# EAGLE schematic powerboard (EAGLE 9.6.2)
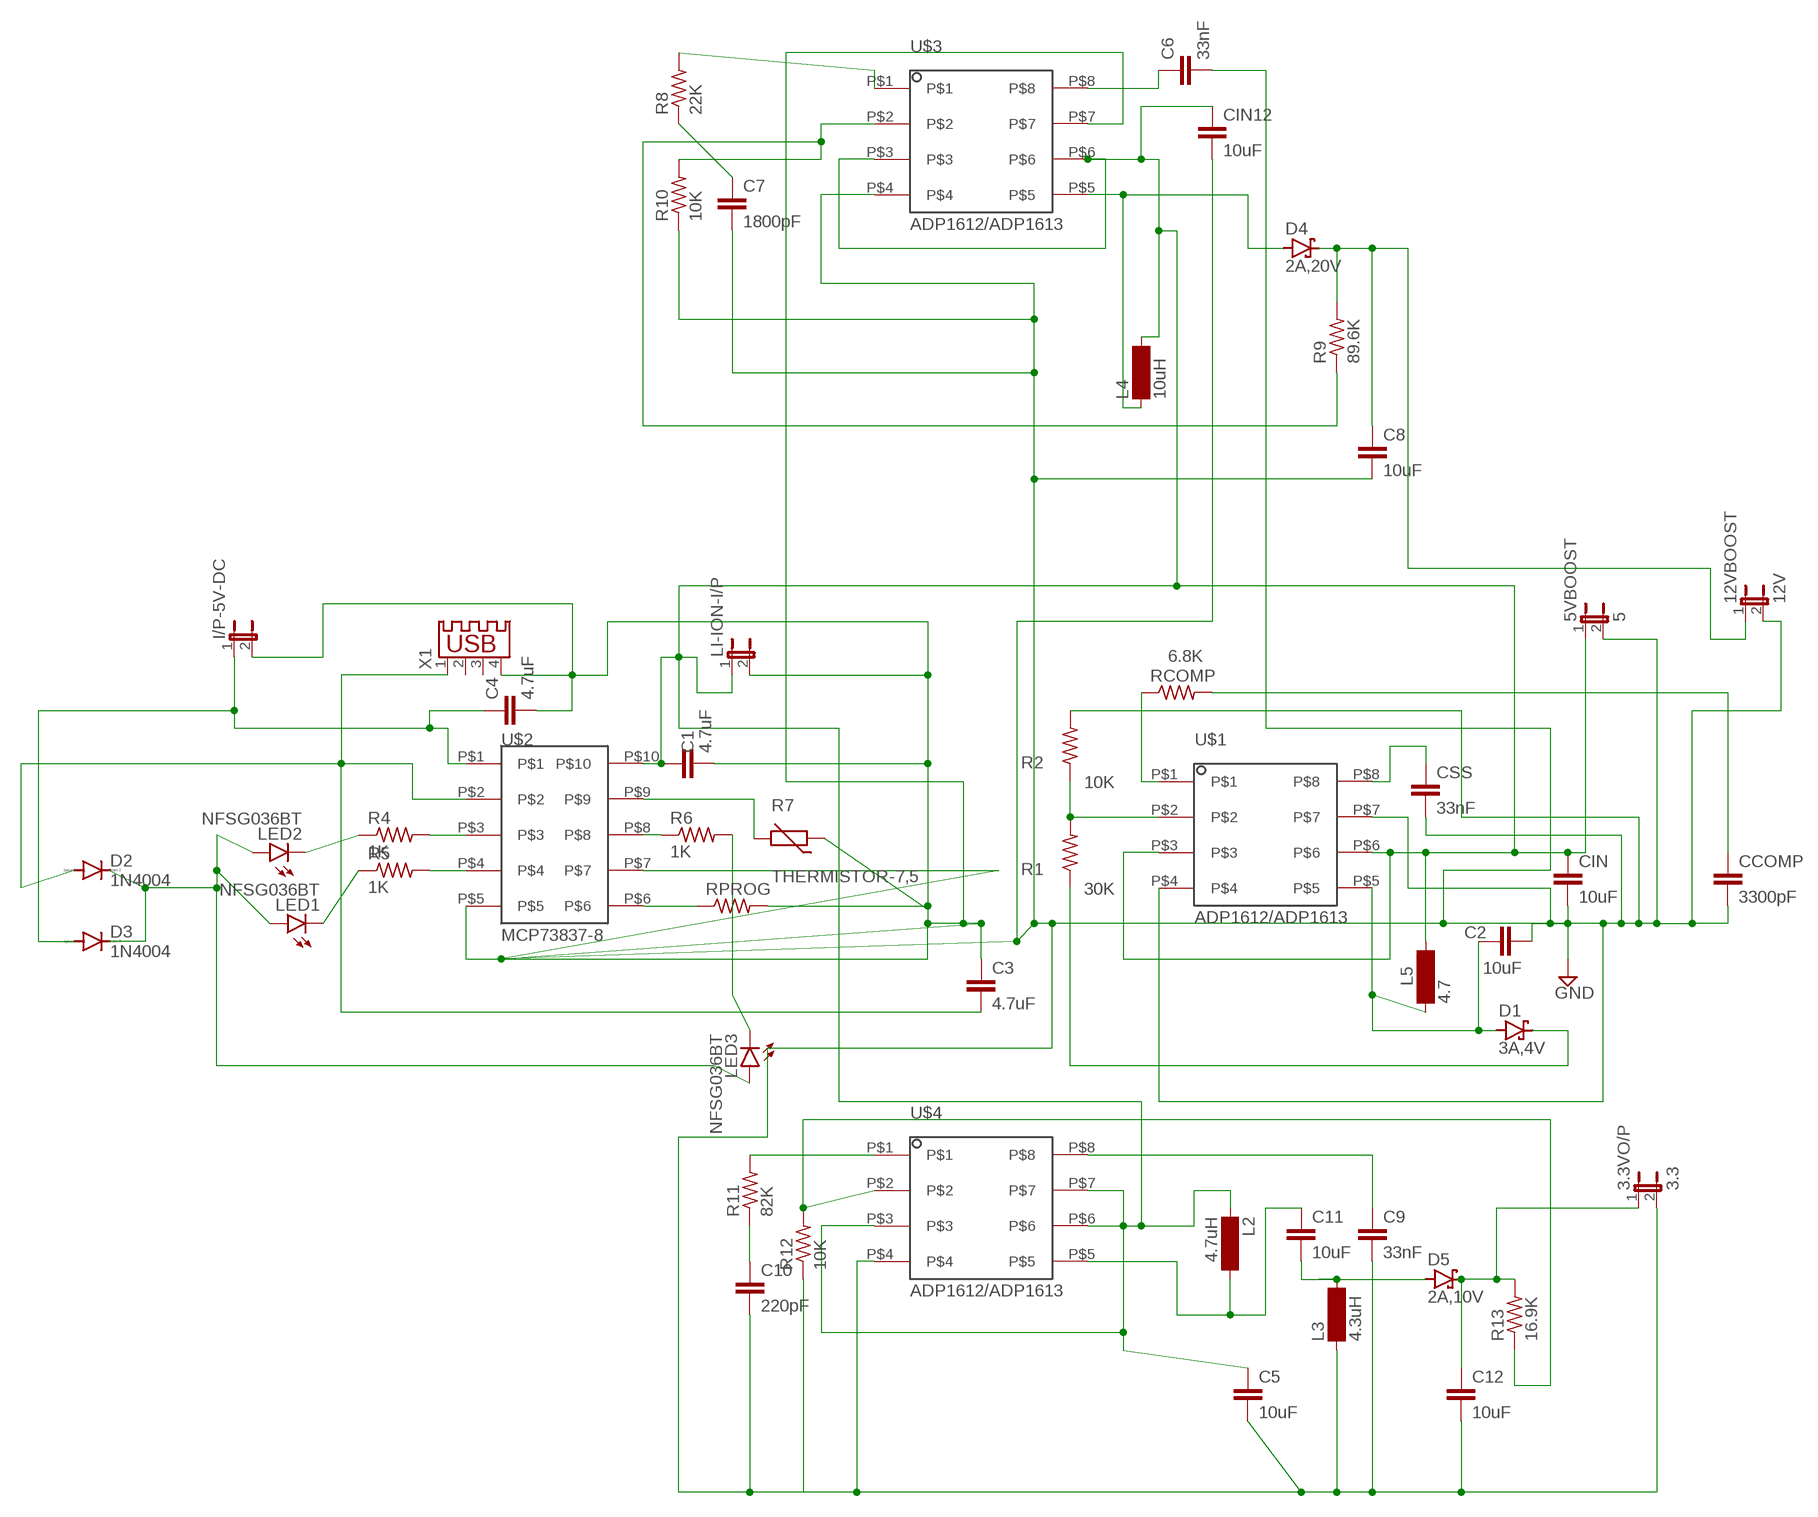
[diagram p0: schematic, sheet 1]

## Parts
3.3VO/P  3.3  JP1E  [JP1]
5VBOOST  5  JP1E  [JP1]
12VBOOST  12V  JP1E  [JP1]
C1  4.7uF  C2,5-3  [C2.5-3]
C2  10uF  C2.5/2  [C2.5-2]
C3  4.7uF  C2,5-3  [C2.5-3]
C4  4.7uF  C2,5-3  [C2.5-3]
C5  10uF  C2.5/2  [C2.5-2]
C6  33nF  C2,5-3  [C2.5-3]
C7  1800pF  C2,5-3  [C2.5-3]
C8  10uF  C2,5-3  [C2.5-3]
C9  33nF  C2.5/2  [C2.5-2]
C10  220pF  C2.5/2  [C2.5-2]
C11  10uF  C2.5/2  [C2.5-2]
C12  10uF  C2.5/2  [C2.5-2]
CCOMP  3300pF  C2.5/2  [C2.5-2]
CIN  10uF  C2,5-3  [C2.5-3]
CIN12  10uF  C2,5-3  [C2.5-3]
CSS  33nF  C2.5/2  [C2.5-2]
D1  3A,4V  SCHOTTKY-DIODEDO35-7  [DO35-7]
D2  1N4004  [DO41-10]
D3  1N4004  [DO41-10]
D4  2A,20V  SCHOTTKY-DIODEDO35-7  [DO35-7]
D5  2A,10V  SCHOTTKY-DIODEDO35-7  [DO35-7]
I/P-5V-DC  JP1E  [JP1]
L2  4.7uH  BS75  [BS75]
L3  4.3uH  BS75  [BS75]
L4  10uH  BS75  [BS75]
L5  4.7  BS75  [BS75]
LED1  NFSG036BT  [NFSG036BT]
LED2  NFSG036BT  [NFSG036BT]
LED3  NFSG036BT  [NFSG036BT]
LI-ION-I/P  JP1E  [JP1]
R1  30K  R-US_0207/10  [0207/10]
R2  10K  R-US_0207/10  [0207/10]
R4  1K  R-US_R0805  [R0805]
R5  1K  R-US_R0805  [R0805]
R6  1K  R-US_R0805  [R0805]
R7  THERMISTOR-7,5  [R-7,5]
R8  22K  R-US_0204/7  [0204/7]
R9  89.6K  R-US_0204/7  [0204/7]
R10  10K  R-US_0204/7  [0204/7]
R11  82K  R-US_0204/7  [0204/7]
R12  10K  R-US_0204/7  [0204/7]
R13  16.9K  R-US_0204/7  [0204/7]
RCOMP  6.8K  R-US_0207/10  [0207/10]
RPROG  R-US_R0805  [R0805]
U$1  ADP1612/ADP1613  [ADP1612/ADP1613]
U$2  MCP73837-8  [MCP73837/8]
U$3  ADP1612/ADP1613  [ADP1612/ADP1613]
U$4  ADP1612/ADP1613  [ADP1612/ADP1613]
X1  USB-A003  [USB-A003]

## Nets
GND: 3.3VO/P.2 5VBOOST.2 12VBOOST.2 C1.2 C2.2 C3.1 C4.2 C5.2 C6.2 C7.2 C8.2 C9.2 C10.2 C12.2 CCOMP.2 CIN12.2 CIN.2 CSS.2 I/P-5V-DC.2 L3.1 LI-ION-I/P.2 R2.2 R7.1 R10.1 R12.1 RPROG.2 U$1.P$4 U$1.P$7 U$2.P$5 U$2.P$7 U$3.P$4 U$3.P$7 U$4.P$4 X1.4
N$1: C6.1 U$3.P$8
N$2: C2.1 D1.A L5.1 U$1.P$5
N$3: R1.2 R2.1 U$1.P$2
N$4: D1.C R1.1
N$5: RCOMP.1 U$1.P$1
N$6: CCOMP.1 RCOMP.2
N$7: CSS.1 U$1.P$8
N$8: R7.2 U$2.P$9
N$9: RPROG.1 U$2.P$6
N$10: 5VBOOST.1 C1.1 C5.1 CIN12.1 CIN.1 L2.1 L4.2 L5.2 LI-ION-I/P.1 U$1.P$3 U$1.P$6 U$2.P$10 U$3.P$3 U$3.P$6 U$4.P$3 U$4.P$6 U$4.P$7
N$11: R4.2 U$2.P$3
N$12: R5.2 U$2.P$4
N$13: R6.1 U$2.P$8
N$14: LED2.C R4.1
N$15: LED1.C R5.1
N$16: LED3.C R6.2
N$17: D2.C D3.C LED1.A LED2.A LED3.A
N$18: D4.A L4.1 U$3.P$5
N$19: C3.2 D2.A U$2.P$2 X1.1
N$20: R8.2 U$3.P$1
N$21: C4.1 D3.A I/P-5V-DC.1 U$2.P$1
N$22: C7.1 R8.1
N$23: R9.1 R10.2 U$3.P$2
N$24: 12VBOOST.1 C8.1 D4.C R9.2
N$26: C11.1 L2.2 U$4.P$5
N$28: C9.1 U$4.P$8
N$31: R11.2 U$4.P$1
N$32: C10.1 R11.1
N$34: R12.2 R13.1 U$4.P$2
N$36: C11.2 D5.A L3.2
N$38: 3.3VO/P.1 C12.1 D5.C R13.2
Unconnected: X1.2 X1.3

## Library data of the parts
3.3VO/P 5VBOOST 12VBOOST I/P-5V-DC LI-ION-I/P = jumper:JP1E: JUMPER
C1-C12 CCOMP CIN CIN12 CSS = capacitor-wima:C: CAPACITOR naming: grid - package width
D1 D4 D5 = diode:SCHOTTKY-DIODE: Schottky Diode
D2 D3 = diode:1N4004: DIODE general purpose rectifier, 1 A
L2-L5 = inductor-neosid:BS: INDUCTOR nominal inductance, magnetically screened; OC_FARNELL: unknown; OC_NEWARK: unknown
LED1-LED3 = led:NFSG036BT: CHIP TYPE GREEN LED NFSx036xT Source: NICHIA CORPORATION .. NFSG036BT-E.pdf
R1 R2 R4-R6 R8-R13 RCOMP RPROG = rcl:R-US_: RESISTOR, American symbol; SPICEPREFIX: R
R7 = varistor:THERMISTOR: THERMISTOR
U$1 U$3 U$4 = VinodADPreg:ADP1612/ADP1613
U$2 = vinMCP73837-8:MCP73837-8
X1 = con-yamaichi:USB-A003: USB connector; OC_FARNELL: unknown; OC_NEWARK: unknown